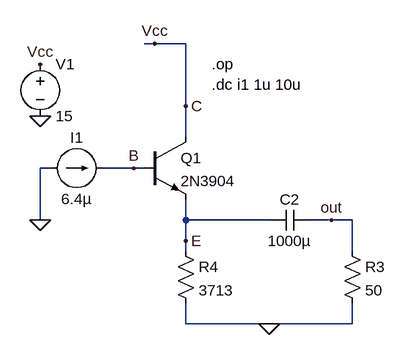
[diagram p0: schematic EF-ckt-gm.asc]
EF-ckt-gm.asc, the LTspice schematic file:
Version 4
SHEET 1 880 680
WIRE 224 32 208 32
WIRE 272 32 224 32
WIRE 272 128 272 32
WIRE 272 176 272 128
WIRE 64 224 48 224
WIRE 192 224 144 224
WIRE 208 224 192 224
WIRE 48 304 48 224
WIRE 272 304 272 272
WIRE 400 304 272 304
WIRE 496 304 464 304
WIRE 528 304 496 304
WIRE 272 336 272 304
WIRE 272 352 272 336
WIRE 528 352 528 304
WIRE 272 464 272 432
WIRE 400 464 272 464
WIRE 528 464 528 432
WIRE 528 464 400 464
FLAG 48 144 0
FLAG 48 64 Vcc
FLAG 224 32 Vcc
FLAG 400 464 0
FLAG 192 224 B
FLAG 272 336 E
FLAG 272 128 C
FLAG 48 304 0
FLAG 496 304 out
DATAFLAG 352 304 "$"
SYMBOL voltage 48 48 R0
SYMATTR InstName V1
SYMATTR Value 15
SYMBOL Res 256 336 R0
SYMATTR InstName R4
SYMATTR Value 3713
SYMBOL npn 208 176 R0
SYMATTR InstName Q1
SYMATTR Value 2N3904
SYMBOL Cap 400 320 R270
WINDOW 0 32 32 VTop 2
WINDOW 3 0 32 VBottom 2
SYMATTR InstName C2
SYMATTR Value 1000µ
SYMBOL Res 512 336 R0
SYMATTR InstName R3
SYMATTR Value 50
SYMBOL current 64 224 R270
WINDOW 0 32 40 VTop 2
WINDOW 3 -32 40 VBottom 2
SYMATTR InstName I1
SYMATTR Value 6.4µ
TEXT 312 64 Left 2 !.op\n.dc i1 1u 10u

The netlist it stands for:
* EF-ckt-gm.asc
V1 C 0 15
R4 E 0 3713
Q1 C B E 0 2N3904
C2 E out 1000µ
R3 out 0 50
I1 0 B 6.4µ
.model NPN NPN
.model PNP PNP
.lib standard.bjt
.op
.dc i1 1u 10u
.backanno
.end

* Results of the author's LTspice run, read from the files saved beside the schematic
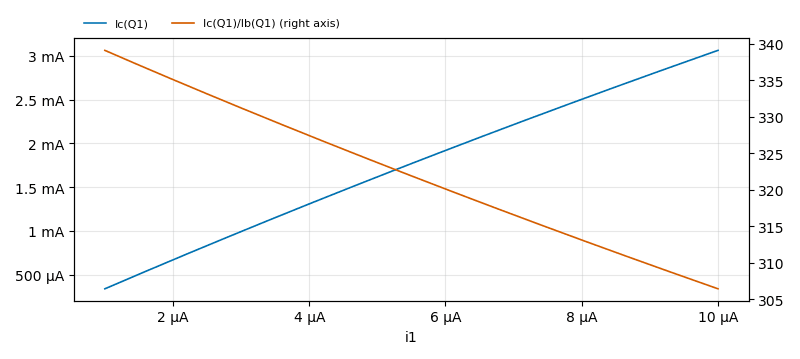
[diagram p1: DC transfer characteristic of EF-ckt-gm.asc, plotted from the saved traces]
* DC transfer characteristic, 1 run:
*   Ic(Q1): 339.1 µA at i1=1 µA, 3.064 mA at i1=10 µA, min 339.1 µA, max 3.064 mA
*   Ic(Q1)/Ib(Q1): 339.1  at i1=1 µA, 306.4  at i1=10 µA, min 306.4 , max 339.1 